# Altium schematic sheet DriverBoard.SchDoc
size A4; Author: Zhang YuXiang; DrawnBy: Zhang YuXiang
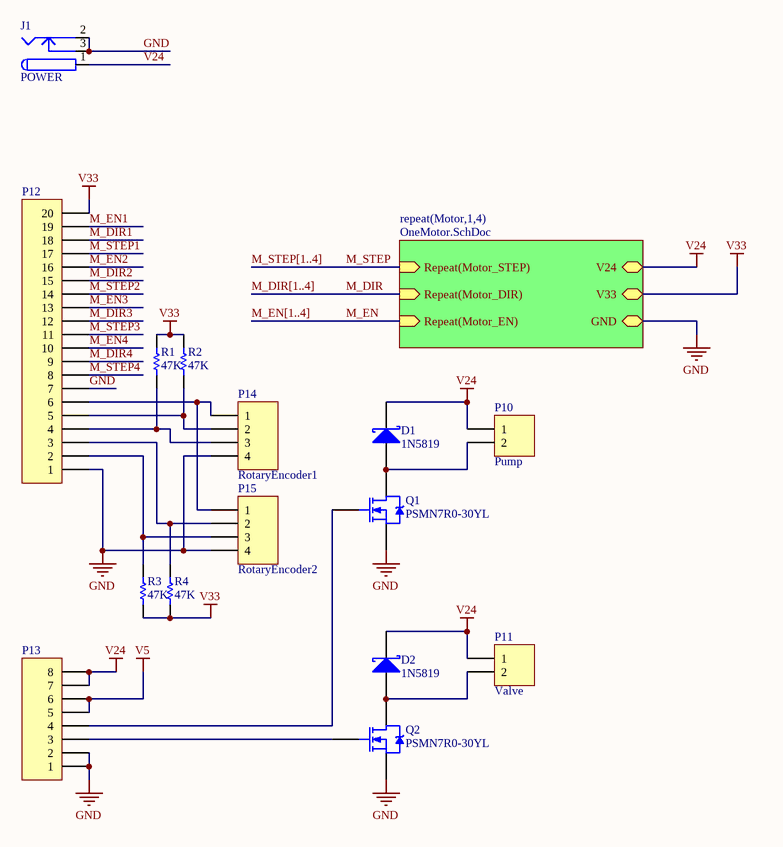
[diagram p0: DriverBoard.SchDoc]

## Parts
D1  1N5819  [DO-214AC]
D2  1N5819  [DO-214AC]
J1  POWER  [DC_POWER]
P10  Pump  [HDR1X2H]
P11  Valve  [HDR1X2H]
P12  Header 20  [HDR1X20]  (value not drawn)
P13  Header 8  [HDR1X8]  (value not drawn)
P14  RotaryEncoder1  [HDR1X4H]
P15  RotaryEncoder2  [HDR1X4H]
Q1  PSMN7R0-30YL  [SOT669]
Q2  PSMN7R0-30YL  [SOT669]
R1  value 47K  [R-1608[0603]]  (hidden comment: Res Semi)
R2  value 47K  [R-1608[0603]]  (hidden comment: Res Semi)
R3  value 47K  [R-1608[0603]]  (hidden comment: Res Semi)
R4  value 47K  [R-1608[0603]]  (hidden comment: Res Semi)

## Sub-sheets
repeat(Motor,1,4) = OneMotor.SchDoc: Repeat(Motor_STEP) (in), Repeat(Motor_DIR) (in), Repeat(Motor_EN) (in), V24, V33, GND

## Nets
GND: J1.2 J1.3 P12.1 P12.7 P13.1 P13.2 P14.4 P15.4 Q1.3(S) Q2.3(S) ; sheet repeat(Motor,1,4)/GND
V5: P13.5 P13.6
V24: D1.2(K) D2.2(K) J1.1 P10.1 P11.1 P13.7 P13.8 ; sheet repeat(Motor,1,4)/V24
V33: P12.20 R1.2 R2.2 R3.1 R4.1 ; sheet repeat(Motor,1,4)/V33
M_DIR: sheet repeat(Motor,1,4)/Repeat(Motor_DIR)
M_DIR1: P12.18
M_DIR2: P12.15
M_DIR3: P12.12
M_DIR4: P12.9
M_EN: sheet repeat(Motor,1,4)/Repeat(Motor_EN)
M_EN1: P12.19
M_EN2: P12.16
M_EN3: P12.13
M_EN4: P12.10
M_STEP: sheet repeat(Motor,1,4)/Repeat(Motor_STEP)
M_STEP1: P12.17
M_STEP2: P12.14
M_STEP3: P12.11
M_STEP4: P12.8
NetD1_1: D1.1(A) P10.2 Q1.2(D)
NetD2_1: D2.1(A) P11.2 Q2.2(D)
NetP12_2: P12.2 P15.3 R3.2
NetP12_3: P12.3 P15.2 R4.2
NetP12_4: P12.4 P14.3 R1.1
NetP12_5: P12.5 P14.2 R2.1
NetP12_6: P12.6 P14.1 P15.1
NetP13_3: P13.3 Q2.1(G)
NetP13_4: P13.4 Q1.1(G)

## Buses and harness runs
bus M_DIR[1..4]
bus M_EN[1..4]
bus M_STEP[1..4]

## Library data of the parts
D1 D2 = D Schottky: Schottky Diode; Published: 8-Jun-2000; LatestRevisionDate: 17-Jul-2002; LatestRevisionNote: Re-released for DXP Platform.; PackageReference: SMB; Publisher: Altium Limited; Code_JEDEC: DO-214-AA
J1 = POWER2.5
P10 P11 = Header 2H: Header, 2-Pin, Right Angle; LatestRevisionDate: 17-Jul-2002; LatestRevisionNote: Re-released for DXP Platform.; Publisher: Altium Limited
P12 = Header 20: Header, 20-Pin; LatestRevisionDate: 17-Jul-2002; LatestRevisionNote: Re-released for DXP Platform.; Publisher: Altium Limited
P13 = Header 8: Header, 8-Pin; LatestRevisionDate: 17-Jul-2002; LatestRevisionNote: Re-released for DXP Platform.; Publisher: Altium Limited
P14 P15 = Header 4H: Header, 4-Pin, Right Angle; LatestRevisionDate: 17-Jul-2002; LatestRevisionNote: Re-released for DXP Platform.; Publisher: Altium Limited
Q1 Q2 = NMOS-2: N-Channel Power MOSFET; Note: Pin 2 is electrically connected to pin 4.; Published: 8-Jun-2000; LatestRevisionDate: 17-Jul-2002; LatestRevisionNote: Re-released for DXP Platform.; DatasheetDocument: PD-9.814; PackageReference: TO-220AB; Publisher: Altium Limited; Code_JEDEC: TO-220-AB; ComponentLink1Description: Manufacturer Link; ComponentLink1URL: http://www.irf.com/
R1-R4 = Res Semi: Semiconductor Resistor; Published: 8-Jun-2000; LatestRevisionDate: 17-Jul-2002; LatestRevisionNote: Re-released for DXP Platform.; PackageReference: AXIAL-0.5; Publisher: Altium Limited